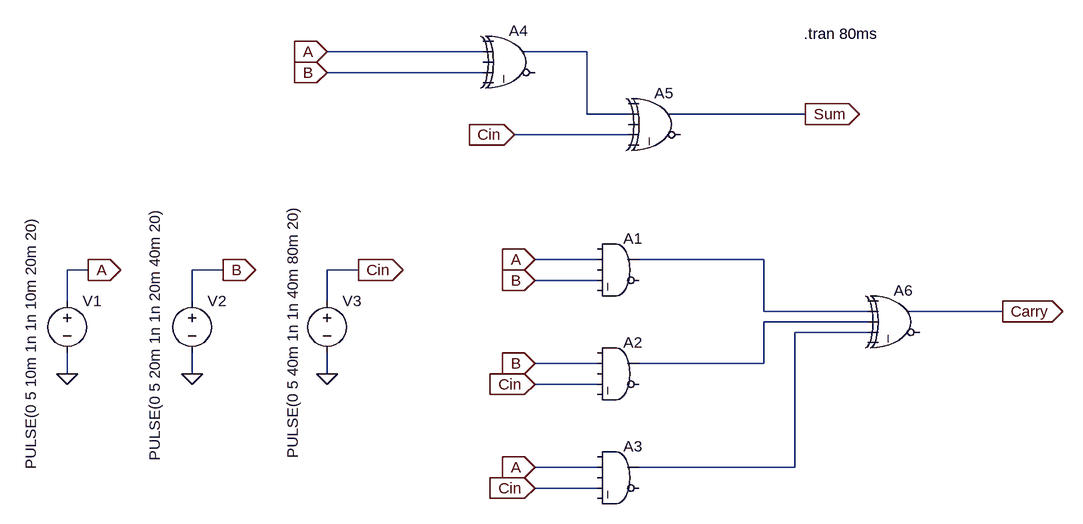
[diagram p0: schematic Full Adder.asc]
Full Adder.asc, the LTspice schematic file:
Version 4
SHEET 1 1468 680
WIRE 544 -368 304 -368
WIRE 704 -368 608 -368
WIRE 544 -336 304 -336
WIRE 704 -272 704 -368
WIRE 768 -272 704 -272
WIRE 1040 -272 832 -272
WIRE 768 -240 592 -240
WIRE 720 -48 624 -48
WIRE 976 -48 784 -48
WIRE -64 -32 -96 -32
WIRE 144 -32 96 -32
WIRE 352 -32 304 -32
WIRE 720 -16 624 -16
WIRE -96 16 -96 -32
WIRE 96 16 96 -32
WIRE 304 16 304 -32
WIRE 976 32 976 -48
WIRE 1136 32 976 32
WIRE 1344 32 1200 32
WIRE 1136 48 976 48
WIRE 1136 64 1024 64
WIRE 720 112 624 112
WIRE 976 112 976 48
WIRE 976 112 784 112
WIRE -96 128 -96 96
WIRE 96 128 96 96
WIRE 304 128 304 96
WIRE 720 144 624 144
WIRE 720 272 624 272
WIRE 1024 272 1024 64
WIRE 1024 272 784 272
WIRE 720 304 624 304
FLAG -64 -32 A
IOPIN -64 -32 Out
FLAG 144 -32 B
IOPIN 144 -32 Out
FLAG 352 -32 Cin
IOPIN 352 -32 Out
FLAG 304 128 0
FLAG 96 128 0
FLAG -96 128 0
FLAG 304 -368 A
IOPIN 304 -368 In
FLAG 304 -336 B
IOPIN 304 -336 In
FLAG 592 -240 Cin
IOPIN 592 -240 In
FLAG 1040 -272 Sum
IOPIN 1040 -272 Out
FLAG 624 -48 A
IOPIN 624 -48 In
FLAG 624 -16 B
IOPIN 624 -16 In
FLAG 624 112 B
IOPIN 624 112 In
FLAG 624 144 Cin
IOPIN 624 144 In
FLAG 624 272 A
IOPIN 624 272 In
FLAG 624 304 Cin
IOPIN 624 304 In
FLAG 1344 32 Carry
IOPIN 1344 32 Out
SYMBOL voltage -96 0 R0
WINDOW 3 -56 -116 VRight 2
WINDOW 123 0 0 Left 0
WINDOW 39 0 0 Left 0
SYMATTR InstName V1
SYMATTR Value PULSE(0 5 10m 1n 1n 10m 20m 20)
SYMBOL voltage 96 0 R0
WINDOW 3 -57 -129 VRight 2
WINDOW 123 0 0 Left 0
WINDOW 39 0 0 Left 0
SYMATTR InstName V2
SYMATTR Value PULSE(0 5 20m 1n 1n 20m 40m 20)
SYMBOL voltage 304 0 R0
WINDOW 3 -53 259 VLeft 2
WINDOW 123 0 0 Left 0
WINDOW 39 0 0 Left 0
SYMATTR InstName V3
SYMATTR Value PULSE(0 5 40m 1n 1n 40m 80m 20)
SYMBOL Digital\\and 752 -96 R0
SYMATTR InstName A1
SYMBOL Digital\\and 752 64 R0
SYMATTR InstName A2
SYMBOL Digital\\and 752 224 R0
SYMATTR InstName A3
SYMBOL Digital\\xor 592 -416 R0
SYMATTR InstName A4
SYMBOL Digital\\xor 816 -320 R0
SYMATTR InstName A5
SYMBOL Digital\\xor 1184 -16 R0
SYMATTR InstName A6
TEXT 1038 -396 Left 2 !.tran 80ms

The netlist it stands for:
* Full Adder.asc
V1 A 0 PULSE(0 5 10m 1n 1n 10m 20m 20)
V2 B 0 PULSE(0 5 20m 1n 1n 20m 40m 20)
V3 Cin 0 PULSE(0 5 40m 1n 1n 40m 80m 20)
A1 0 A 0 B 0 0 N002 0 AND
A2 0 B 0 Cin 0 0 N003 0 AND
A3 0 A 0 Cin 0 0 N004 0 AND
A4 0 A 0 B 0 0 N001 0 XOR
A5 0 N001 0 Cin 0 0 Sum 0 XOR
A6 0 N002 N003 N004 0 0 Carry 0 XOR
.tran 80ms
.backanno
.end